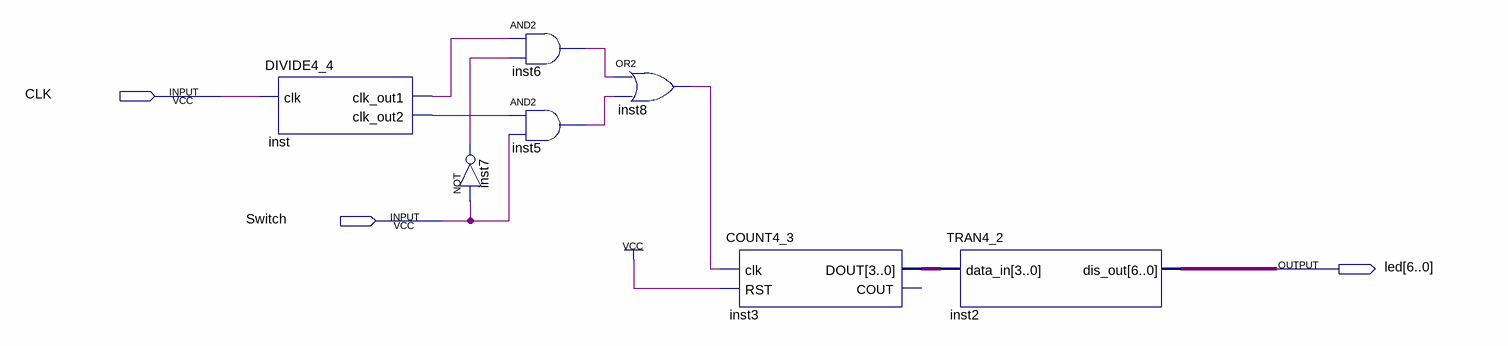
[diagram p0: schematic sheet]
// Quartus schematic FINAL4_5.bdf as structural Verilog: 7 symbols, 3 pins
module FINAL4_5 (
  input  CLK,
  input  Switch,
  output [6:0] led
);

  wire inst5_out, inst6_out, inst7_out, inst8_out, inst_clk_out1, inst_clk_out2;
  wire [3:0] inst3_dout;

  DIVIDE4_4 inst (.clk(CLK), .clk_out1(inst_clk_out1), .clk_out2(inst_clk_out2));
  not inst7 (inst7_out, Switch);
  and inst6 (inst6_out, inst_clk_out1, inst7_out);
  and inst5 (inst5_out, inst_clk_out2, Switch);
  or inst8 (inst8_out, inst6_out, inst5_out);
  COUNT4_3 inst3 (.clk(inst8_out), .RST(1'b1), .DOUT(inst3_dout));  // open: COUT
  TRAN4_2 inst2 (.data_in(inst3_dout), .dis_out(led));
endmodule
